# EasyEDA Pro project ProPrj_国赛G题模拟滤波_2025-07-30.epro

# Schematic Schematic1
Board Name: Board1; Create Date: 2025-07-30; Page Name: P1; Project Name: 国赛G题模拟滤波; Schematic Name: Schematic1; Update Date: 2025-07-30; Company: 嘉立创EDA; Page Size: A4; Version: V1.0
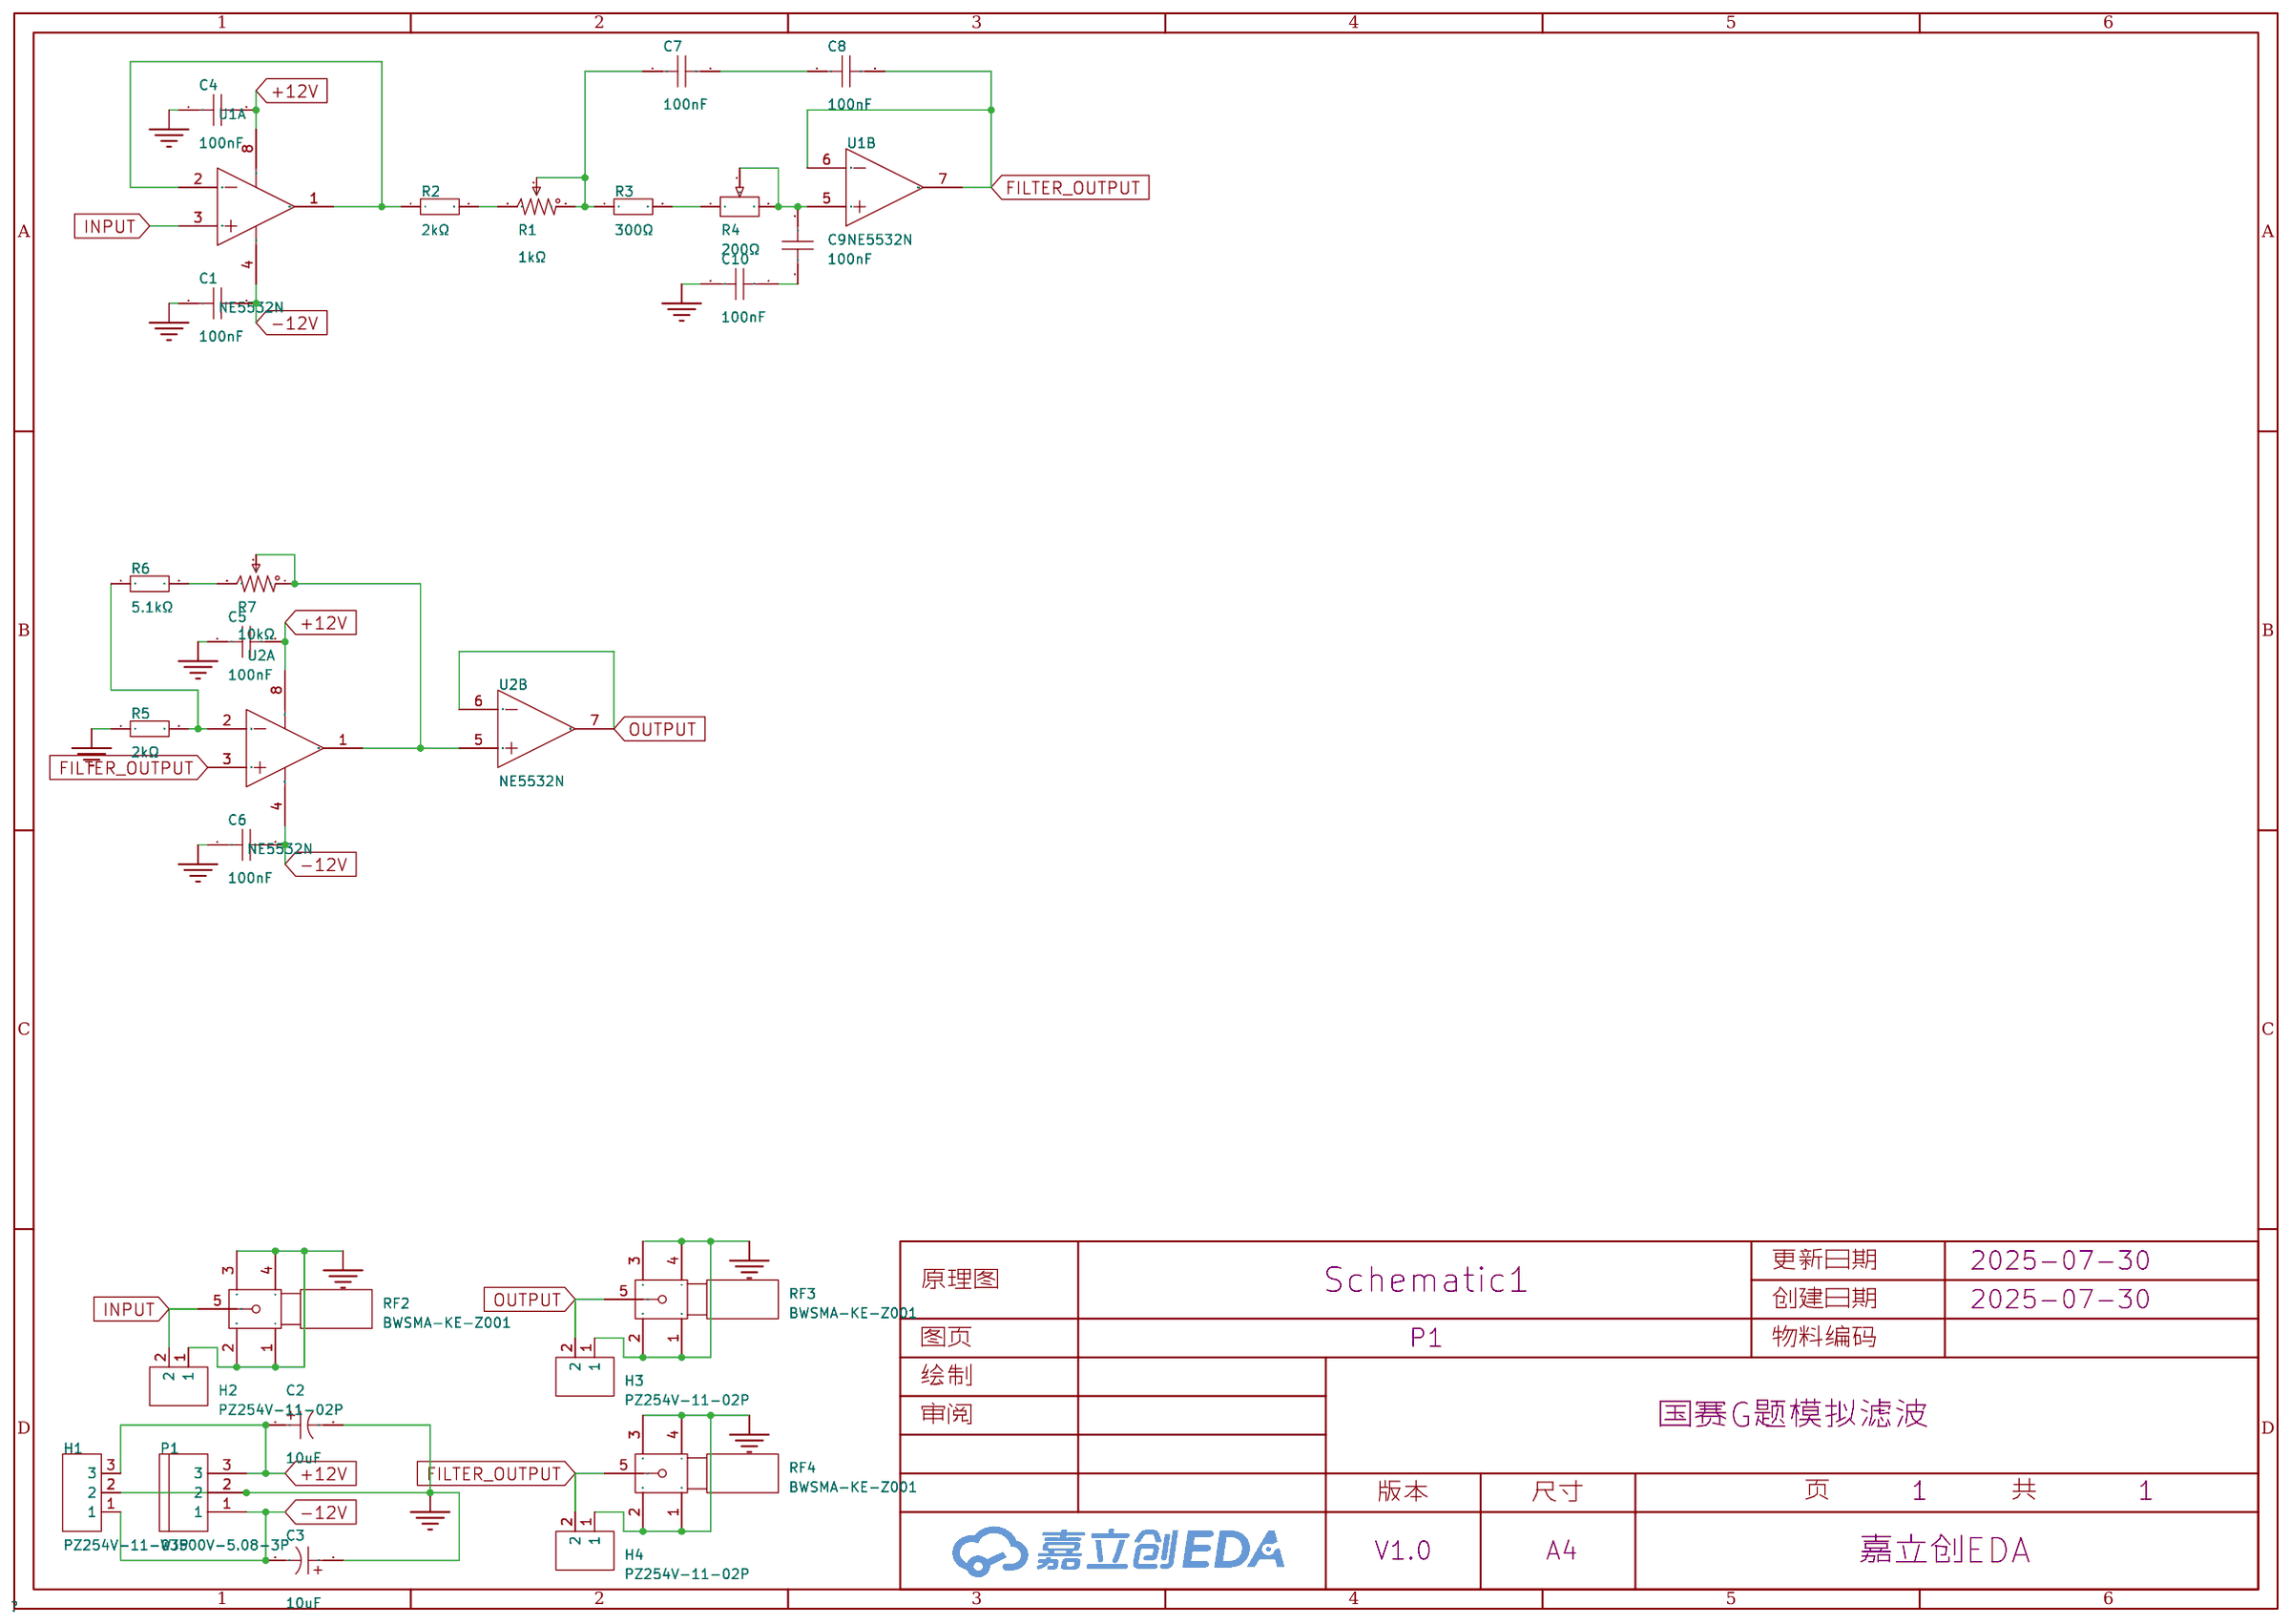
[diagram p0: schematic sheet]

## Parts
C1  100nF  [CAP-TH_L5.8-W2.4-P2.54-D0.6]
C2  10uF  [CAP-TH_BD10.0-P5.00-D0.6-FD_1]
C3  10uF  [CAP-TH_BD10.0-P5.00-D0.6-FD_1]
C4  100nF  [CAP-TH_L5.8-W2.4-P2.54-D0.6]
C5  100nF  [CAP-TH_L5.8-W2.4-P2.54-D0.6]
C6  100nF  [CAP-TH_L5.8-W2.4-P2.54-D0.6]
C7  100nF  [CAP-TH_L5.8-W2.4-P2.54-D0.6]
C8  100nF  [CAP-TH_L5.8-W2.4-P2.54-D0.6]
C9  100nF  [CAP-TH_L5.8-W2.4-P2.54-D0.6]
C10  100nF  [CAP-TH_L5.8-W2.4-P2.54-D0.6]
H1  PZ254V-11-03P  [HDR-TH_3P-P2.54-V-M]
H2  PZ254V-11-02P  [HDR-TH_2P-P2.54-V-M]
H3  PZ254V-11-02P  [HDR-TH_2P-P2.54-V-M]
H4  PZ254V-11-02P  [HDR-TH_2P-P2.54-V-M]
P1  WJ500V-5.08-3P  [CONN-TH_3P-P5.00_WJ500V-5.08-3P]
R1  1kΩ  [RES-ADJ-TH_3P-L10.0-W10.0-P2.50-BL-BS]
R2  2kΩ  [Res_1/8W]
R3  300Ω  [Res_1/8W]
R4  200Ω  [RES-ADJ-TH_3P-L9.5-W4.9-P2.50-L_3296W]
R5  2kΩ  [Res_1/8W]
R6  5.1kΩ  [Res_1/8W]
R7  10kΩ  [RES-ADJ-TH_3P-L10.0-W10.0-P2.50-L]
RF2  BWSMA-KE-Z001  [SMA-TH_BWSMA-KE-Z001]
RF3  BWSMA-KE-Z001  [SMA-TH_BWSMA-KE-Z001]
RF4  BWSMA-KE-Z001  [SMA-TH_BWSMA-KE-Z001]
U1  NE5532N  [DIP-8_L9.3-W6.4-P2.54-LS7.6-BL]  (sections 1,2)
U2  NE5532N  [DIP-8_L9.3-W6.4-P2.54-LS7.6-BL]  (sections 1,2)

## Library data of the parts
C1 C4-C10 = CC1H104ZA1ED3F5P1100: 容值:100nF;精度:-20%~+80%;额定电压:50V;温度系数:Y5V;; LCSC Part Name: 100nF -20%~+80% 50V; Supplier Part: C2832506; Manufacturer: Dersonic(德尔创); Supplier Footprint: 插件,P=2.54mm; JLCPCB Part Class: 扩展库; Datasheet: https://atta.szlcsc.com/upload/public/pdf/source/20211027/619020FDD8EBC9BBFCA73A5584FA164D.pdf; Supplier: LCSC; Tolerance: -20%~+80%; Voltage Rated: 50V; Lead Spacing: 2.54mm; Temperature Coefficient: Y5V; φD: 5.8mm; Body Thickness: 2.4mm
C2 C3 = ERG450V10M10x16: 容值:10uF;精度:±20%;额定电压:450V;纹波电流:100mA@100kHz;等效串联电阻(ESR):9.45Ω@100kHz;; LCSC Part Name: 10uF ±20% 450V; Supplier Part: C46552835; Manufacturer: 捷而瑞; Supplier Footprint: 插件,D10xL16mm; JLCPCB Part Class: Extended Part; Datasheet: https://atta.szlcsc.com/upload/public/pdf/source/20250526/717B4C76834FE5C4A331D19A222D031C.pdf; Supplier: LCSC; Tolerance: ±20%; Voltage Rating: 450V; Ripple Current: 100mA@100kHz; Equivalent Series Resistance(ESR): 9.45Ω@100kHz; Pin Spacing: 5mm; Diameter: 10mm; Height - Seated (Max): 16mm; Lifetime: 2000hrs@105℃; Operating Temperature: -25℃~+105℃
H1 = PZ254V-11-03P: 插针结构:1x3P;间距:2.54mm;行距:-;圆针/方针:方针;安装方式:直插;排数:单排;总PIN位数:3P;额定电流:3A;额定电压:250V;配合针长度:6mm;塑高:2.5mm;端接针长度:3mm;工作温度:-40℃~+105℃;颜色:黑色;; LCSC Part Name: 1x3P 间距:2.54mm 方针 直插; Supplier Part: C2937625; Manufacturer: XFCN(兴飞); Supplier Footprint: 插件,P=2.54mm; JLCPCB Part Class: 扩展库; Datasheet: https://atta.szlcsc.com/upload/public/pdf/source/20200309/C492402_8335C3D49C4E4C618838D59BB1D024C1.pdf; Supplier: LCSC; Pin Structure: 1x3P; Pitch: 2.54mm; Circluar Pins/Square Pins: 方针; Mounting Type: 直插; Number of Rows: 单排; Number of Pins: 3P; Current Rating: 3A; Voltage Rating (Max): 250V; Length of Mating Pin: 6mm; Insulation Height: 2.5mm; Length of End Connection Pin: 3mm; Operating Temperature: -40℃~+105℃; Color: 黑色
H2-H4 = PZ254V-11-02P: 插针结构:1x2P;间距:2.54mm;行距:-;圆针/方针:方针;安装方式:直插;排数:单排;总PIN位数:2P;额定电流:-;额定电压:-;配合针长度:6mm;塑高:2.5mm;端接针长度:3mm;触头材质:黄铜;触头镀层:-;工作温度:-40℃~+105℃;颜色:黑色;; LCSC Part Name: 1x2P 间距:2.54mm 方针 直插; Supplier Part: C492401; Manufacturer: XFCN(兴飞); Supplier Footprint: 插件,P=2.54mm; JLCPCB Part Class: 扩展库; Datasheet: https://atta.szlcsc.com/upload/public/pdf/source/20200309/C492401_A812433581A9B211A7FFA413ADDFF0E5.pdf; Supplier: LCSC; Pin Structure: 1x2P; Pitch: 2.54mm; Circluar Pins/Square Pins: 方针; Mounting Type: 直插; Number of Rows: 单排; Number of Pins: 2P; Length of Mating Pin: 6mm; Insulation Height: 2.5mm; Length of End Connection Pin: 3mm; Contact Material: 黄铜; Operating Temperature: -40℃~+105℃; Color: 黑色
P1 = WJ500V-5.08-3P: 结构:1x3P;间距:5.08mm;颜色:绿色;安装方式:直插;额定电流:18A;额定电压:250V;排数:1;线规 - AWG:14~30;线规 - 平方毫米:2.5;每排PIN数:3;工作温度范围:-40℃~+105℃;; LCSC Part Name: 5.08mm 1x3P 排数:1 每排P数:3 直插; Supplier Part: C72334; Manufacturer: KANGNEX(康奈克斯电气); Supplier Footprint: 插件,P=5.08mm; JLCPCB Part Class: 扩展库; Datasheet: https://atta.szlcsc.com/upload/public/pdf/source/20191225/C72334_8A5EF831D67650233B6B1E3F2BC06274.pdf; Supplier: LCSC; Structure: 1x3P; Pitch: 5.08mm; Color: 绿色; Mounting Style: 直插; Current Rating (Max): 18A; Voltage Rating (Max): 250V; Number of Pins: 3P; Number of Rows: 1; Wire Gauge - AWG: 14~30; Wire Gauge - mm2: 2.5; Number of PINs Per Row: 3; Operating Temperature Range: -40℃~+105℃
R1 = 3296W-1-102: 阻值:1kΩ;精度:±10%;; LCSC Part Name: 1kΩ ±10%; Supplier Part: C118949; Manufacturer: BOCHEN(博晨); Supplier Footprint: 插件; JLCPCB Part Class: 扩展库; Datasheet: https://atta.szlcsc.com/upload/public/pdf/source/20171114/C118949_15106326635991117438.pdf; Supplier: LCSC; Tolerance: ±10%
R2 R3 R5 R6 = Res_AXIAL-1/8W: Supplier Footprint: 轴向引线
R4 = 3296W-1-201: 阻值:200Ω;精度:±10%;; LCSC Part Name: 200Ω ±10%; Supplier Part: C118939; Manufacturer: BOCHEN(博晨); Supplier Footprint: 插件; JLCPCB Part Class: 扩展库; Datasheet: https://atta.szlcsc.com/upload/public/pdf/source/20171114/C118939_15106326614771117428.pdf; Supplier: LCSC; Tolerance: ±10%
R7 = 3296W-1-103: 阻值:10kΩ;精度:±10%;; LCSC Part Name: 10kΩ ±10%; Supplier Part: C118954; Manufacturer: BOCHEN(博晨); Supplier Footprint: 插件; JLCPCB Part Class: 扩展库; Datasheet: https://atta.szlcsc.com/upload/public/pdf/source/20171114/C118954_15106326646611117443.pdf; Supplier: LCSC; Tolerance: ±10%
RF2-RF4 = BWSMA-KE-Z001_C496549: 连接器类型:板端;接口类型:内孔;端口数量:1;接口直径:-;接口长度/高度:-;频率-最大值:-;射频系列:SMA;阻抗:50Ω;样式:正脚;触头材质:-;触头镀层:-;工作温度范围:-65℃~+165℃;焊接温度(最大值):-;; LCSC Part Name: 内孔 SMA 正脚; Supplier Part: C496549; Manufacturer: BAT WIRELESS(蝙蝠无线); Supplier Footprint: 插件; JLCPCB Part Class: 扩展库; Datasheet: https://atta.szlcsc.com/upload/public/pdf/source/20221228/40BF41E56A06003A0210E1785CA66EA6.pdf; Supplier: LCSC; Connector Type: 板端; Interface Type: 内孔; Number of Ports: 1; RF Series: SMA; Impedance: 50Ω; Style: 正脚; Operating Temperature Range: -65℃~+165℃
U1 U2 = NE5532N: 放大器数:双路;轨到轨:-;增益带宽积(GBP):10MHz;输入失调电压(Vos):5mV;压摆率(SR):11V/us;输入偏置电流(Ib):500nA;; Supplier Part: C2987282; Manufacturer: HGSEMI(华冠); Supplier Footprint: DIP-8; JLCPCB Part Class: 扩展库; Datasheet: https://atta.szlcsc.com/upload/public/pdf/source/20220420/2D3D2D023E04B50C3DA859F976397601.pdf; Supplier: LCSC; Number of Channels: 双路; Maximum Power Supply Range (Vdd-Vss): 44V; Gain Bandwidth Product: 10MHz; Vos - Input Offset Voltage: 5mV; Slew Rate: 11V/us; Ib - Input Bias Current: 500nA; Input Offset Current(Ios): 200nA; Noise density(eN): 8nV/√Hz@1kHz; Common Mode Rejection Ratio(CMRR): 100dB; Operating Temperature: 0℃~+70℃; Dual Supply: ±22V

## Nets
+12V: C2.1 C4.2 C5.2 H1.3 P1.3 U1.8(VCC+) U2.8(VCC+)
-12V: C1.2 C3.2 C6.2 H1.1 P1.1 U1.4(VCC-) U2.4(VCC-)
GND: C1.1 C2.2 C3.1 C4.1 C5.1 C6.1 C10.2 H1.2 H2.1 H3.1 H4.1 P1.2 R5.1 RF2.1 RF2.2 RF2.3 RF2.4 RF3.1 RF3.2 RF3.3 RF3.4 RF4.1 RF4.2 RF4.3 RF4.4
FILTER_OUTPUT: C8.2 H4.2 RF4.5 U1.6(IN2-) U1.7(OUT2) U2.3(IN1+)
INPUT: H2.2 RF2.5 U1.3(IN1+)
OUTPUT: H3.2 RF3.5 U2.6(IN2-) U2.7(OUT2)
$1N1690: R2.1 U1.1(OUT1) U1.2(IN1-)
$1N1984: C9.2 R4.2 R4.3 U1.5(IN2+)
$1N1998: R3.2 R4.1
$1N2003: C7.1 R1.1 R1.2 R3.1
$1N2019: R1.3 R2.2
$1N2241: C9.1 C10.1
$1N2259: C7.2 C8.1
$1N2356: R5.2 R6.1 U2.2(IN1-)
$1N2492: R6.2 R7.3
$1N2496: R7.1 R7.2 U2.1(OUT1) U2.5(IN2+)

# Board PCB1
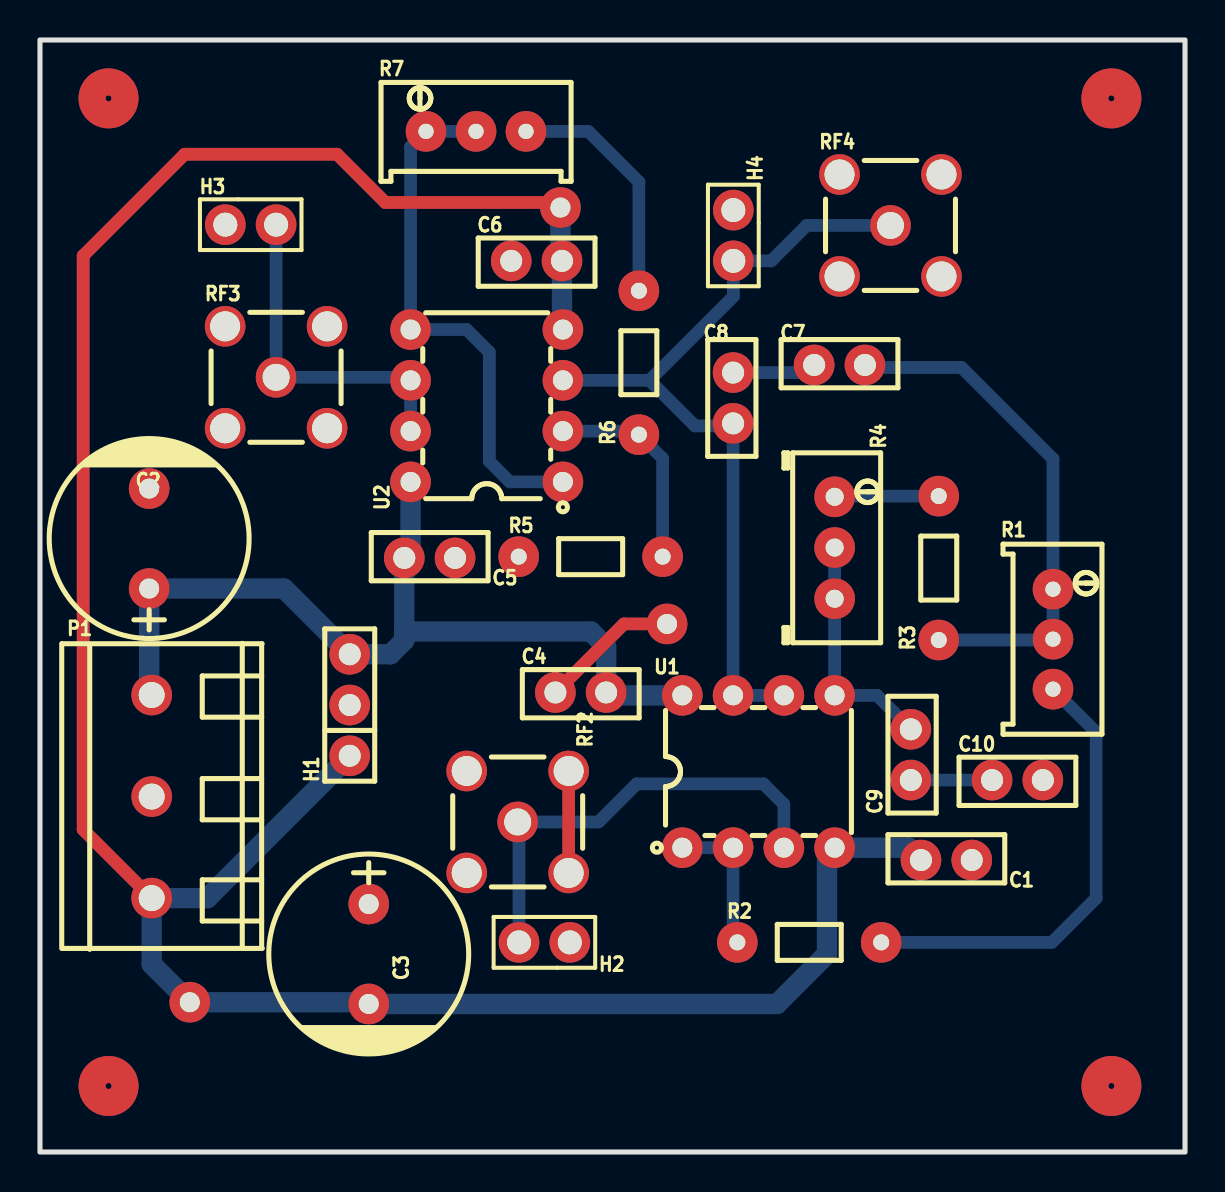
[diagram p1: board, top side]
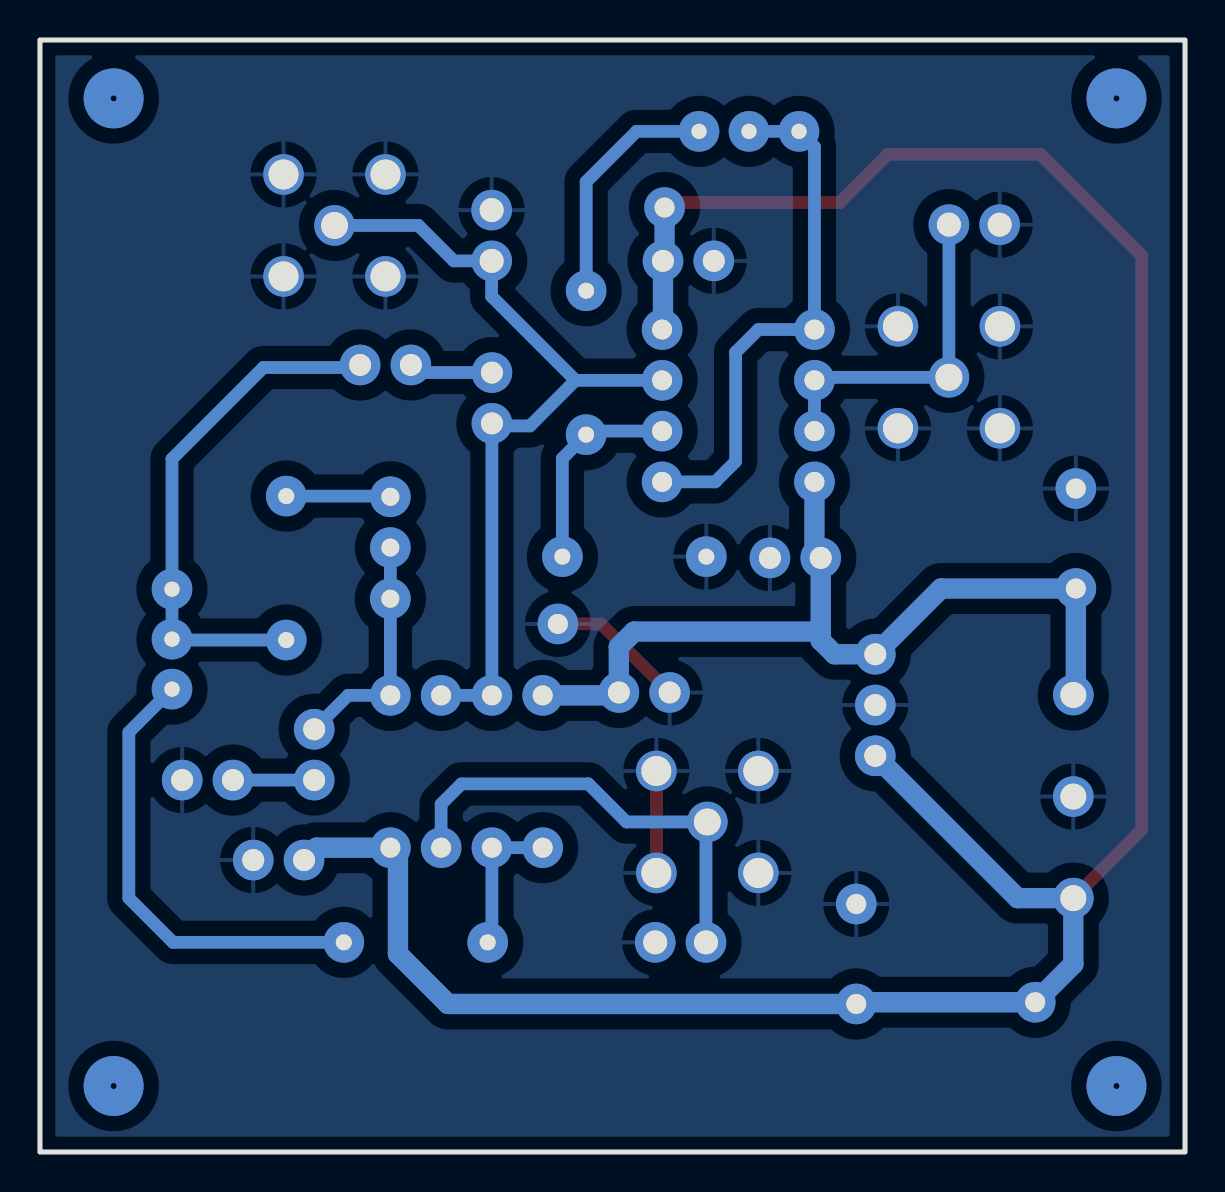
[diagram p2: board, bottom side, seen from below]

Outline 57.28 x 55.63 mm; copper layers: Top Layer, Bottom Layer. Coordinates in mm from the lower left corner of the outline.
Outline path: rectangle 0,55.63 57.28,0
Stack: Top Layer 0.035mm / Dielectric1 1.51mm FR4 er 4.5 / Bottom Layer 0.035mm

## Design rules (mm)
template: 自定义配置
spacing copperThickness1oz (default): track to track 0.102, other pairs 0.152 to 0.3
spacing copperThickness2oz: track to track 0.203, other pairs 0.152 to 0.3
track width copperThickness1oz (default): min 0.127, default 0.254, max 2.54
track width copperThickness2oz: min 0.203, default 0.254, max 2.54
differential pair differentialPair (default): width min 0.127, default 0.254, max 2.54; gap min 0.152, default 0.152
via viaSize (default): diameter min 0.5, default 0.61, max 10; hole min 0.3, default 0.305, max 6.3

## Placement (name value [footprint] x y rotation side)
C1  100nF  [CAP-TH_L5.8-W2.4-P2.54-D0.6]  45.34 14.61 180 top
C2  10uF  [CAP-TH_BD10.0-P5.00-D0.6-FD_1]  5.46 30.69 90 top
C3  10uF  [CAP-TH_BD10.0-P5.00-D0.6-FD_1]  16.44 9.91 270 top
C4  100nF  [CAP-TH_L5.8-W2.4-P2.54-D0.6]  27.05 22.99 0 top
C5  100nF  [CAP-TH_L5.8-W2.4-P2.54-D0.6]  19.49 29.72 180 top
C6  100nF  [CAP-TH_L5.8-W2.4-P2.54-D0.6]  24.84 44.58 0 top
C7  100nF  [CAP-TH_L5.8-W2.4-P2.54-D0.6]  40 39.37 180 top
C8  100nF  [CAP-TH_L5.8-W2.4-P2.54-D0.6]  34.67 37.72 270 top
C9  100nF  [CAP-TH_L5.8-W2.4-P2.54-D0.6]  43.56 19.88 90 top
C10  100nF  [CAP-TH_L5.8-W2.4-P2.54-D0.6]  48.9 18.61 0 top
H1  PZ254V-11-03P  [HDR-TH_3P-P2.54-V-M]  15.49 22.36 90 top
H2  PZ254V-11-02P  [HDR-TH_2P-P2.54-V-M]  25.23 10.49 180 top
H3  PZ254V-11-02P  [HDR-TH_2P-P2.54-V-M]  10.54 46.39 0 top
H4  PZ254V-11-02P  [HDR-TH_2P-P2.54-V-M]  34.68 45.85 270 top
NOREF  -  [Pad_e89]  7.49 7.49 90 top
NOREF#2  -  [Pad_e85]  26.03 47.24 90 top
NOREF#3  -  [Pad_e361]  31.37 26.42 90 top
P1  WJ500V-5.08-3P  [CONN-TH_3P-P5.00_WJ500V-5.08-3P]  5.59 17.78 90 top
R1  1kΩ  [RES-ADJ-TH_3P-L10.0-W10.0-P2.50-BL-BS]  50.67 25.65 0 top
R2  2kΩ  [Res_1/8W]  38.48 10.42 0 top
R3  300Ω  [Res_1/8W]  45.02 29.21 90 top
R4  200Ω  [RES-ADJ-TH_3P-L9.5-W4.9-P2.50-L_3296W]  39.75 30.23 270 top
R5  2kΩ  [Res_1/8W]  27.55 29.72 0 top
R6  5.1kΩ  [Res_1/8W]  30.02 39.48 90 top
R7  10kΩ  [RES-ADJ-TH_3P-L10.0-W10.0-P2.50-L]  21.81 51.05 0 top
RF2  BWSMA-KE-Z001  [SMA-TH_BWSMA-KE-Z001]  23.9 16.51 270 top
RF3  BWSMA-KE-Z001  [SMA-TH_BWSMA-KE-Z001]  11.81 38.75 0 top
RF4  BWSMA-KE-Z001  [SMA-TH_BWSMA-KE-Z001]  42.54 46.35 0 top
U1  NE5532N  [DIP-8_L9.3-W6.4-P2.54-LS7.6-BL]  35.94 19.03 0 top
U2  NE5532N  [DIP-8_L9.3-W6.4-P2.54-LS7.6-BL]  22.35 37.33 90 top

## Footprints (pads in the part's own frame, mm; a bottom-side part is the same pattern mirrored in y, then rotated)
CAP-TH_BD10.0-P5.00-D0.6-FD_1
  round 2.032 hole 1: 1(-2.5,0) 2(2.5,0)
CAP-TH_L5.8-W2.4-P2.54-D0.6
  round 2.032 hole 1.1: 1(-1.27,0) 2(1.27,0)
CONN-TH_3P-P5.00_WJ500V-5.08-3P
  round 2.032 hole 1.3: 1(-5.08,0) 2(0,0) 3(5.08,0)
DIP-8_L9.3-W6.4-P2.54-LS7.6-BL
  round 2.032 hole 1: 1(-3.81,-3.81) 2(-1.27,-3.81) 3(1.27,-3.81) 4(3.81,-3.81) 5(3.81,3.81) 6(1.27,3.81) 7(-1.27,3.81) 8(-3.81,3.81)
HDR-TH_2P-P2.54-V-M
  round 2.032 hole 1.2: 1(-1.27,0) 2(1.27,0)
HDR-TH_3P-P2.54-V-M
  round 2.032 hole 1.1: 1(-2.54,0) 2(0,0) 3(2.54,0)
Pad_e85
  round 2.032 hole 1: 1(0,0)
Pad_e89
  round 2.032 hole 1: 1(0,0)
Pad_e361
  round 2.032 hole 1: 1(0,0)
RES-ADJ-TH_3P-L9.5-W4.9-P2.50-L_3296W
  round 2.032 hole 0.9: 1(-2.55,0) 2(-0.01,0) 3(2.55,0)
RES-ADJ-TH_3P-L10.0-W10.0-P2.50-BL-BS
  round 2.032 hole 0.762: 1(0,2.5) 2(0,0) 3(0,-2.5)
RES-ADJ-TH_3P-L10.0-W10.0-P2.50-L
  round 2.032 hole 0.762: 1(-2.5,0) 2(0,0) 3(2.5,0)
Res_1/8W
  round 2.032 hole 0.8: 1(-3.599,0.063) 2(3.599,0.063)
SMA-TH_BWSMA-KE-Z001
  round 2.032 hole 1.5: 1(-2.55,-2.55) 2(-2.55,2.55) 3(2.55,2.55) 4(2.55,-2.55)
  round 2.032 hole 1.35: 5(0,0)

## Nets
As in the schematic, except:
-12V: C1.2 C3.2 C6.2 H1.1 NOREF.1 NOREF#2.1 P1.1 U1.4 U2.4
GND: C1.1 C2.2 C3.1 C4.1 C5.1 C6.1 C10.2 H1.2 H2.1 H3.1 H4.1 NOREF#3.1 P1.2 R5.1 RF2.1 RF2.2 RF2.3 RF2.4 RF3.1 RF3.2 RF3.3 RF3.4 RF4.1 RF4.2 RF4.3 RF4.4

## Via types
v1: diameter 3, hole 0.305, Top Layer to Bottom Layer, 4 vias

## Routing (per net, layer and track width the routed paths; a pad name or vN(x,y) marks a point on that pad's centre or on a via; arc(x,y) is an arc through that point)
+12V: length 44.4
  Bottom Layer w1.016: 18.22,26.04 27.56,26.04 28.32,25.27 C4.2 28.47,22.84 U1.8 ; 18.22,26.04 18.22,29.72 18.54,30.03 U2.8 ; 18.22,26.04 18.22,25.59 17.53,24.9 15.49,24.9 12.21,28.19 C2.1 5.46,22.99 P1.3
-12V: length 128.6
  Top Layer w0.635: P1.1 2.16,16.13 2.16,44.83 7.24,49.91 14.86,49.91 17.27,47.5 25.78,47.5 NOREF#2.1
  Bottom Layer w1.016: C1.2 43.45,15.22 U1.4 39.37,14.84 39.37,9.91 36.87,7.41 C3.2 16.36,7.49 NOREF.1 5.59,9.4 P1.1 8.38,12.7 H1.1 ; NOREF#2.1 26.03,44.65 C6.2 26.11,41.19 U2.4
GND: length 12.1
  Top Layer w0.635: C4.1 29.21,26.42 NOREF#3.1 ; RF2.2 RF2.3
(no net):
  vias: v1(3.43,52.7) v1(3.43,3.3) v1(53.59,52.7) v1(53.59,3.3)
FILTER_OUTPUT: length 42
  Bottom Layer w0.635: 30.49,38.6 32.77,36.32 34.54,36.32 34.67,36.45 U1.7 U1.6 ; 30.49,38.6 U2.3 ; 30.49,38.6 34.68,42.8 H4.2 36.58,44.58 38.35,46.35 42.54,46.35
INPUT: length 22.8
  Bottom Layer w0.635: H2.2 23.96,16.44 RF2.5 27.94,16.51 29.84,18.42 36.19,18.42 37.21,17.4 37.21,15.22
OUTPUT: length 17
  Bottom Layer w0.635: U2.7 U2.6 18.38,38.75 RF3.5 H3.2
$1N1690: length 7.4
  Bottom Layer w0.635: R2.1 34.67,10.7 U1.2 U1.1
$1N1984: length 11.9
  Bottom Layer w0.635: 39.75,22.84 R4.3 R4.2 ; U1.5 41.86,22.84 C9.2
$1N1998: length 5.2
  Bottom Layer w0.635: R3.2 39.78,32.81 R4.1
$1N2003: length 26.1
  Bottom Layer w0.635: R3.1 50.63,25.61 R1.2 R1.1 50.67,34.67 46.1,39.24 41.39,39.24 41.26,39.37
$1N2019: length 23
  Bottom Layer w0.635: R2.2 50.62,10.49 52.83,12.7 52.83,21 R1.3
$1N2241: length 4.1
  Bottom Layer w0.635: C9.1 C10.1
$1N2259: length 4.2
  Bottom Layer w0.635: C8.1 38.34,38.99 C7.2
$1N2356: length 10.5
  Bottom Layer w0.635: U2.2 29.78,36.06 R6.1 31.15,34.7 R5.2
$1N2492: length 12.1
  Bottom Layer w0.635: R7.3 27.43,51.05 29.96,48.53 R6.2
$1N2496: length 26.7
  Bottom Layer w0.635: U2.1 23.5,33.52 22.48,34.54 22.48,40.01 21.34,41.14 U2.5 18.54,50.28 R7.1 R7.2

## Copper pours and planes (outline as drawn; the poured copper is in the pictures)
GND on Bottom Layer: 0,55.63 57.28,55.63 57.28,0 0,0
